# EAGLE schematic _EmbeddedPCB.33aa806d-3ddb-4efb-9624-6a5cfd5aa2a7 (EAGLE 9.7.0)
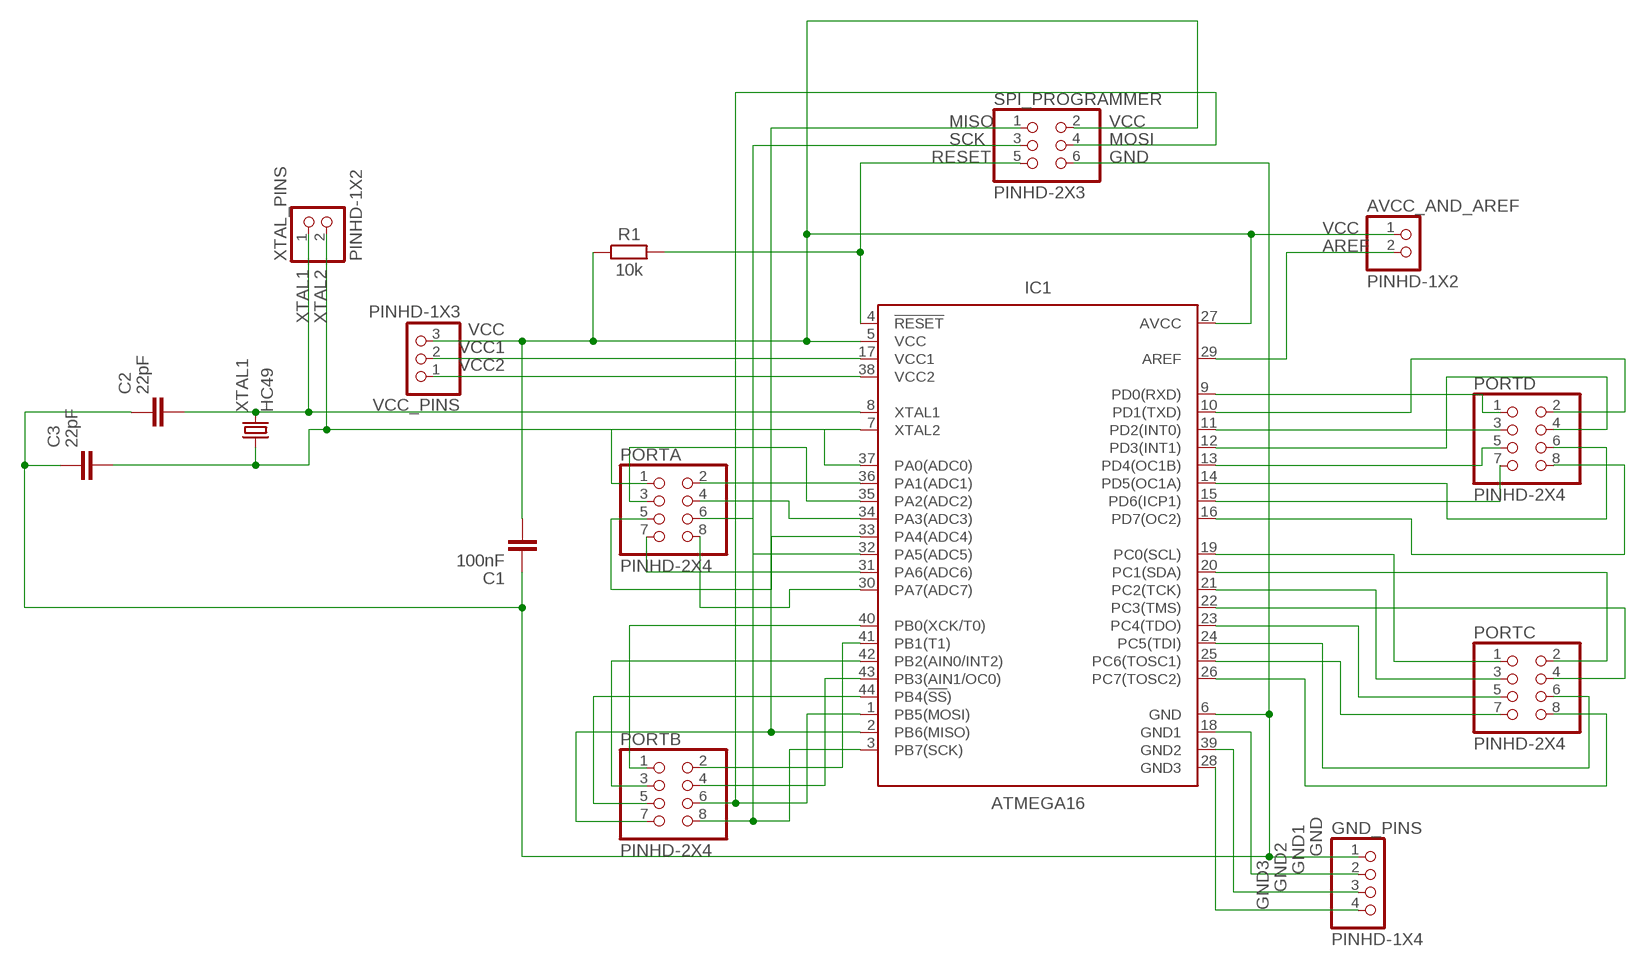
[diagram p0: schematic, sheet 1]

## Parts
AVCC_AND_AREF  PINHD-1X2  [1X02]
C1  100nF  C_RADIAL-12.5MM-DIA  [CAPRD550W60D1025H1250B]
C2  22pF  C_RADIAL-12.5MM-DIA  [CAPRD550W60D1025H1250B]
C3  22pF  C_RADIAL-12.5MM-DIA  [CAPRD550W60D1025H1250B]
GND_PINS  PINHD-1X4  [1X04]
IC1  ATMEGA16  ATMEGA644P-20AQR_QFP  [QFP80P1200X1200X120-44]
PORTA  PINHD-2X4  [2X04]
PORTB  PINHD-2X4  [2X04]
PORTC  PINHD-2X4  [2X04]
PORTD  PINHD-2X4  [2X04]
R1  10k  R_AXIAL-7.2MM-PITCH  [RESAD724W46L381D178B]
SPI_PROGRAMMER  PINHD-2X3  [2X03]
VCC_PINS  PINHD-1X3  [1X03]
XTAL1  HC49  CRYSTAL_HC49-11.5L  [XTALRR488W45L1150T500H350B]
XTAL_PINS  PINHD-1X2  [1X02]

## Nets
AREF: AVCC_AND_AREF.2 IC1.29(AREF)
GND: C1.1 C2.1 C3.1 GND_PINS.1 IC1.6(GND) SPI_PROGRAMMER.6
GND1: GND_PINS.2 IC1.18(GND1)
GND2: GND_PINS.3 IC1.39(GND2)
GND3: GND_PINS.4 IC1.28(GND3)
MISO: IC1.2(PB6(MISO)) PORTB.7 SPI_PROGRAMMER.1
MOSI: IC1.1(PB5(MOSI)) PORTB.6 SPI_PROGRAMMER.4
N$1: IC1.37(PA0(ADC0)) PORTA.1
N$2: IC1.35(PA2(ADC2)) PORTA.3
N$3: IC1.33(PA4(ADC4)) PORTA.5
N$4: IC1.31(PA6(ADC6)) PORTA.7
N$5: IC1.36(PA1(ADC1)) PORTA.2
N$6: IC1.34(PA3(ADC3)) PORTA.4
N$7: IC1.32(PA5(ADC5)) PORTA.6
N$8: IC1.30(PA7(ADC7)) PORTA.8
N$9: IC1.40(PB0(XCK/T0)) PORTB.1
N$10: IC1.42(PB2(AIN0/INT2)) PORTB.3
N$11: IC1.44(PB4(!SS!)) PORTB.5
N$13: IC1.41(PB1(T1)) PORTB.2
N$14: IC1.43(PB3(AIN1/OC0)) PORTB.4
N$17: IC1.9(PD0(RXD)) PORTD.1
N$18: IC1.11(PD2(INT0)) PORTD.3
N$19: IC1.13(PD4(OC1B)) PORTD.5
N$20: IC1.15(PD6(ICP1)) PORTD.7
N$21: IC1.10(PD1(TXD)) PORTD.2
N$22: IC1.12(PD3(INT1)) PORTD.4
N$23: IC1.14(PD5(OC1A)) PORTD.6
N$24: IC1.16(PD7(OC2)) PORTD.8
N$25: IC1.19(PC0(SCL)) PORTC.1
N$26: IC1.21(PC2(TCK)) PORTC.3
N$27: IC1.23(PC4(TDO)) PORTC.5
N$28: IC1.25(PC6(TOSC1)) PORTC.7
N$29: IC1.20(PC1(SDA)) PORTC.2
N$30: IC1.22(PC3(TMS)) PORTC.4
N$31: IC1.24(PC5(TDI)) PORTC.6
N$32: IC1.26(PC7(TOSC2)) PORTC.8
RESET: IC1.4(!RESET!) R1.2 SPI_PROGRAMMER.5
SCK: IC1.3(PB7(SCK)) PORTB.8 SPI_PROGRAMMER.3
VCC: AVCC_AND_AREF.1 C1.2 IC1.5(VCC) IC1.27(AVCC) R1.1 SPI_PROGRAMMER.2 VCC_PINS.3
VCC1: IC1.17(VCC1) VCC_PINS.2
VCC2: IC1.38(VCC2) VCC_PINS.1
XTAL1: C2.2 IC1.8(XTAL1) XTAL1.2 XTAL_PINS.1
XTAL2: C3.2 IC1.7(XTAL2) XTAL1.1 XTAL_PINS.2

## Library data of the parts
AVCC_AND_AREF XTAL_PINS = Connector:PINHD-1X2: PIN HEADER; CATEGORY: CONNECTOR; SUB-CATEGORY: PIN-HEADER
C1-C3 = Capacitor:C: Capacitor - Generic; CATEGORY: Capacitor
GND_PINS = Connector:PINHD-1X4: PIN HEADER; CATEGORY: CONNECTOR; SUB-CATEGORY: PIN-HEADER
IC1 = IC_Embedded:ATMEGA644*QFP: 8-bit low power, CMOS Microcontroller Datasheet <http://ww1.microchip.com/downloads/en/DeviceDoc/ATmega164A_PA-324A_PA-644A_PA-1284_P_Data-Sheet-40002070B.pdf>; CATEGORY: IC_Embedded; DESCRIPTION: IC MCU 8BIT 64KB FLASH 44TQFP; MANUFACTURER: Microchip Technology; MPN: ATMEGA644P-20AQR; OPERATING_TEMP: -40°C to 105°C; PART_STATUS: Active; SERIES: AVR® ATmega; SPEED: 20MHz; SUB-CATEGORY: Microcontroller
PORTA PORTB PORTC PORTD = Connector:PINHD-2X4: PIN HEADER; CATEGORY: CONNECTOR; SUB-CATEGORY: PIN-HEADER
R1 = Resistor:R: Resistor Fixed - Generic; CATEGORY: Resistor; SUB-CATEGORY: Fixed
SPI_PROGRAMMER = Connector:PINHD-2X3: PIN HEADER; CATEGORY: CONNECTOR; SUB-CATEGORY: PIN-HEADER
VCC_PINS = Connector:PINHD-1X3: PIN HEADER; CATEGORY: CONNECTOR; SUB-CATEGORY: PIN-HEADER
XTAL1 = Frequency-Source:CRYSTAL: Crystal 2Pin - Generic; CATEGORY: Frequency-Source; SUB-CATEGORY: Crystal-2Pin